# Altium project science-board-24.PrjPcb
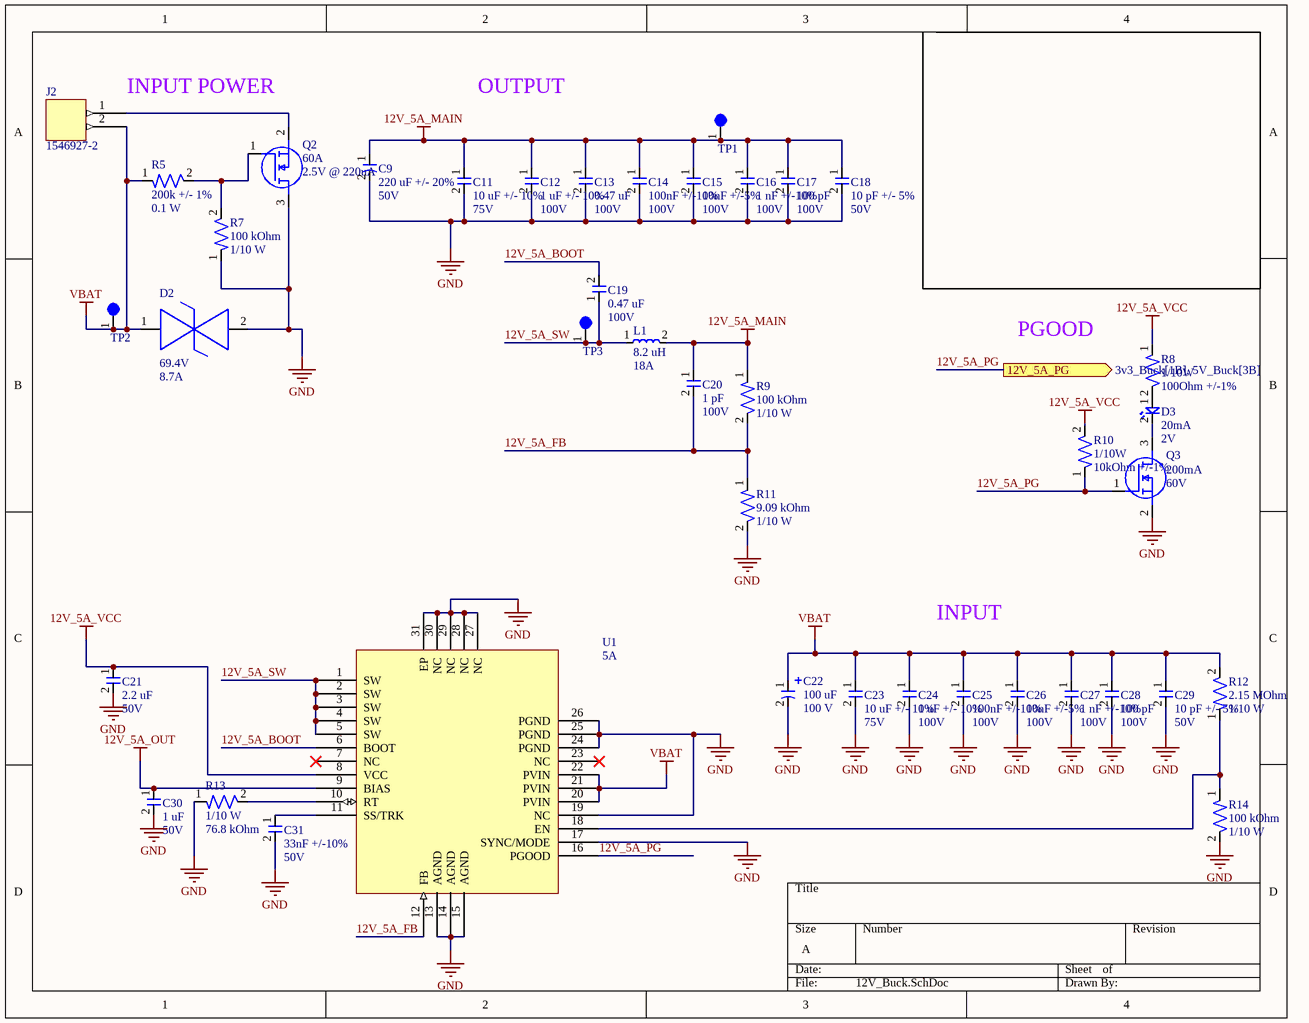
[diagram p0: 12V_Buck.SchDoc]
6 sheets, 231 parts. Net scope: flat (ports and power ports of the same name join across sheets).
Board file: Science_Board_PCB.PcbDoc
Sheets:
  12V_Buck.SchDoc
  5V_Buck.SchDoc
  3v3_Buck.SchDoc
  MCU_Sensors_CAN.SchDoc
  3v3_LDO.SchDoc
  MOSFETS.SchDoc

## Sheet 12V_Buck.SchDoc
size A; SheetNumber: 1; SheetTotal: 6

### Parts
C9  Capacitance: 220 uF +/- 20%  Voltage Rating: 50V  [ELEC-220U-0003]  (hidden comment: 50TZV220M10X10.5)
C11  Capacitance: 10 uF +/- 10%  Voltage Rating: 75V  [CAP-1210]  (hidden comment: C3225X7R1N106K250AC)
C12  Capacitance: 1 uF +/- 10%  Voltage: 100V  [CAP-1206 - duplicate]  (hidden comment: CL31B105KCHNNNE)
C13  Capacitance: 0.47 uF  Voltage: 100V  [CAP-0805]  (hidden comment: KAM21KR72A474KL)
C14  Capacitance: 100nF +/-10%  Voltage Rating: 100V  [CAP-0603]  (hidden comment: CC0603KRX7R0BB104)
C15  Capacitance: 10nF +/-5%  Voltage Rating: 100V  [CAP-0603]  (hidden comment: C1608C0G2A103J080AC)
C16  Capacitance: 1 nF +/-10%  Voltage: 100V  [CAP-0603]  (hidden comment: C0603Y102K1RAC7867)
C17  Capacitance: 100 pF  Voltage: 100V  [CAP-0603]  (hidden comment: 0603N101J101CT)
C18  Capacitance: 10 pF +/- 5%  Voltage Rating: 50V  [CAP-0603]  (hidden comment: 0603N100J500CT)
C19  Capacitance: 0.47 uF  Voltage: 100V  [CAP-0805]  (hidden comment: KAM21KR72A474KL)
C20  Capacitance: 1 pF  Voltage: 100V  [CAP-0603]  (hidden comment: 885012006087)
C21  Capacitance: 2.2 uF  oltage: 50V  [CAP-0603]  (hidden comment: UMK107BBJ225KA-T)
C22  Capacitance: 100 uF  Voltage: 100 V  [ELEC-100U-0001]  (hidden comment: 100SEV100M12.5X16)
C23  Capacitance: 10 uF +/- 10%  Voltage Rating: 75V  [CAP-1210]  (hidden comment: C3225X7R1N106K250AC)
C24  Capacitance: 1 uF +/- 10%  Voltage: 100V  [CAP-1206 - duplicate]  (hidden comment: CL31B105KCHNNNE)
C25  Capacitance: 100nF +/-10%  Voltage Rating: 100V  [CAP-0603]  (hidden comment: CC0603KRX7R0BB104)
C26  Capacitance: 10nF +/-5%  Voltage Rating: 100V  [CAP-0603]  (hidden comment: C1608C0G2A103J080AC)
C27  Capacitance: 1 nF +/-10%  Voltage: 100V  [CAP-0603]  (hidden comment: C0603Y102K1RAC7867)
C28  Capacitance: 100 pF  Voltage: 100V  [CAP-0603]  (hidden comment: 0603N101J101CT)
C29  Capacitance: 10 pF +/- 5%  Voltage Rating: 50V  [CAP-0603]  (hidden comment: 0603N100J500CT)
C30  Capacitance: 1 uF  Voltage: 50V  [CAP-0603]  (hidden comment: UMK107AB7105KA-T)
C31  Capacitance: 33nF +/-10%  Voltage Rating: 50V  [CAP-0603]  (hidden comment: CC0603KRX7R9BB333)
D2  Vclamp: 69.4V  Peak pulser current: 8.7A  [DO-214AA (SMBJ)]  (hidden comment: SMBJE43CAH)
D3  Current Rating: 20mA  Vf: 2V  [LED-0603]  (hidden comment: 150060AS75000)
J2  1546927-2  [CONN-1546927-2]
L1  Inductance: 8.2 uH  DCI: 18A  [PWRIND-8.2U-0002]  (hidden comment: IHLP6767GZER8R2M01)
Q2  Drain Current: 60A  Vgs: 2.5V @ 220uA  [NMOS-8PowerVDFN]  (hidden comment: TPH7R006PL,L1Q)
Q3  Id-Continuous: 200mA  VDS-Max: 60V  [NMOS-SOT23-3]  (hidden comment: T2N7002AK,LM)
R5  Resistance: 200k +/- 1%  Power Rating: 0.1 W  [RES-0603]  (hidden comment: ERJ-3EKF2003V)
R7  Resistance: 100 kOhm  Power: 1/10 W  [RES-0603]  (hidden comment: RC0603FR-07100KL)
R8  Power Rating: 1/10W  Resistance: 100Ohm +/-1%  [RES-0603]  (hidden comment: AC0603FR-10100RL)
R9  Resistance: 100 kOhm  Power: 1/10 W  [RES-0603]  (hidden comment: RC0603FR-07100KL)
R10  Power Rating: 1/10W  Resistance: 10kOhm +/-1%  [RES-0603]  (hidden comment: RC0603FR-0710KP)
R11  Resistance: 9.09 kOhm  Power: 1/10 W  [RES-0603]  (hidden comment: RC0603FR-079K09L)
R12  Resistance: 2.15 MOhm  Power: 1/10 W  [RES-0603]  (hidden comment: RC0603FR-072M15L)
R13  Power: 1/10 W  Resistance: 76.8 kOhm  [RES-0603]  (hidden comment: RC0603FR-0776K8L)
R14  Resistance: 100 kOhm  Power: 1/10 W  [RES-0603]  (hidden comment: RC0603FR-07100KL)
TP1  5003  [TEST-POINT-0001]  (value not drawn)
TP2  5003  [TEST-POINT-0001]  (value not drawn)
TP3  5003  [TEST-POINT-0001]  (value not drawn)
U1  Current: 5A  [IC-30-WQFN(6x4)]  (hidden comment: LM76005RNPR)

### Ports
12V_5A_PG (out, see 3v3_Buck[1B], 5V_Buck[3B])

### Nets
12V_5A_MAIN: C9.1 C11.1 C12.1 C13.1 C14.1 C15.1 C16.1 C17.1 C18.1 C20.1 L1.2 R9.1 TP1.1
12V_5A_OUT: C30.1 U1.9(BIAS)
12V_5A_VCC: C21.1 R8.1 R10.2 U1.8(VCC)
GND: C9.2 C11.2 C12.2 C13.2 C14.2 C15.2 C16.2 C17.2 C18.2 C21.2 C22.2 C23.2 C24.2 C25.2 C26.2 C27.2 C28.2 C29.2 C30.2 C31.2 D2.2 Q2.3(D) Q3.2(S) R7.1 R11.2 R13.1 R14.2 U1.13(AGND) U1.14(AGND) U1.15(AGND) U1.17(SYNC/MODE) U1.19(NC) U1.24(PGND) U1.25(PGND) U1.26(PGND) U1.27(NC) U1.28(NC) U1.29(NC) U1.30(NC) U1.31(EP)
VBAT: C22.1 C23.1 C24.1 C25.1 C26.1 C27.1 C28.1 C29.1 D2.1 J2.2 R5.1 R12.2 TP2.1 U1.20(PVIN) U1.21(PVIN) U1.22(PVIN)
12V_5A_BOOT: C19.2 U1.6(BOOT)
12V_5A_FB: C20.2 R9.2 R11.1 U1.12(FB)
12V_5A_PG: Q3.1(G) R10.1 U1.16(PGOOD) ; port 12V_5A_PG
12V_5A_SW: C19.1 L1.1 TP3.1 U1.1(SW) U1.2(SW) U1.3(SW) U1.4(SW) U1.5(SW)
NetC31_1: C31.1 U1.11(SS/TRK)
NetD3_1: D3.1 R8.2
NetD3_2: D3.2 Q3.3(D)
NetJ2_1: J2.1 Q2.2(S)
NetQ2_1: Q2.1(G) R5.2 R7.2
NetR12_1: R12.1 R14.1 U1.18(EN)
NetR13_2: R13.2 U1.10(RT)

Not connected (* = marked no-connect by the designer): U1 7(NC)* 23(NC)*

### Notes on the sheet
- INPUT POWER
- OUTPUT
- PGOOD
- INPUT

### Library data of the parts
C9 = ELEC-220U-0003: 220 µF 50 V Aluminum Electrolytic Capacitors Radial, Can - SMD 2000 Hrs @ 105°C; Size: .406inx.406in*.413in
C11 C23 = CAP-10U-0004: 10 µF ±10% 75V Ceramic Capacitor X7R 1210 (3225 Metric)
C12 C24 = CAP-1U-0001: 1 µF ±10% 100V Ceramic Capacitor X7R 1206 (3216 Metric)
C13 C19 = CAP-0.47U-0001: 0.47 µF ±10% 100V Ceramic Capacitor X7R 0805 (2012 Metric); Tolerance: +/- 10%; Assembled?: No; Temperature Coefficient: X7R; Package Size: 0805
C14 C25 = CAP-100N-0001: CAP CER 0.1UF 100V X7R 0603; Manufacturer: YAGEO; Assembled?: no; Manufacturer Part Number: CC0603KRX7R0BB104; Temperature Coefficient: X7R; Package Size: 0603
C15 C26 = CAP-10N-0002: CAP CER 10000PF 100V C0G 0603; Manufacturer: TDK Corporation; Temperature Coefficient: C0G/NP0; Assembled?: no; Manufacturer Part Number: C1608C0G2A103J080AC; Package Size: 0603
C16 C27 = CAP-1N-0001: 1000 pF ±10% 100V Ceramic Capacitor X7R 0603 (1608 Metric)
C17 C28 = CAP-100P-0002: 100 pF ±5% 100V Ceramic Capacitor C0G, NP0 0603 (1608 Metric); Tolerance: +/-5%; Temp Coeff: C0G/NP0; Package Size: 0603
C18 C29 = CAP-10P-0001: 10 pF ±5% 50V Ceramic Capacitor C0G, NP0 0603 (1608 Metric); Manufacturer: Walshin Technology Corporation; Assembled?: Yes; Manufacturer Part Number: 0603N100J500CT; Temperature Coefficient: C0G, NP0; Package Size: 0603
C20 = CAP-1P-0001: 1 pF ±0.25pF 100V Ceramic Capacitor C0G, NP0 0603 (1608 Metric); Tolerance: +/- 0.25 pF; Temperature Coefficient: C0G/NP0; Assembled?: No; Package Size: 0603
C21 = CAP-2.2U-0001: 2.2 µF ±10% 50V Ceramic Capacitor X5R 0603 (1608 Metric)
C22 = ELEC-100U-0001: 100 µF 100 V Aluminum Electrolytic Capacitors Radial, Can - SMD 2000 Hrs @ 85°C; Manufacturer: Rubycon; Tolerance: +/- 20%; Assembled?: No; ESR: idk check the datasheet i couldnt find it
C30 = CAP-1U-0002: 1 µF ±10% 50V Ceramic Capacitor X7R 0603 (1608 Metric); Package Size: 0603
C31 = CAP-33N-0001: 0.033 µF ±10% 50V Ceramic Capacitor X7R 0603 (1608 Metric); Manufacturer: YAGEO; Assembled?: no; Manufacturer Part Number: CC0603KRX7R9BB333; Temperature Coefficient: X7R; Package Size: 0603
D2 = DIO-69.4V-0001: 69.4V Clamp 8.7A Ipp Tvs Diode Surface Mount DO-214AA (SMBJ); Channels: Bidirectional; Breakdown VOltage: 47.8V; Reverse working maximum voltage: 43V; Package: DO-214AA (SMBJ)
D3 = LED_Amber_0001: CAP CER 0.1UF 100V X7R 0603; Manufacturer: Wurth Electronik; Assembled?: no; Color: Amber; Manufacturer Part Number: 150060AS75000; Package Size: 0603
J2 = CON-2POS-0003
L1 = PWRIND-8.2U-0002: 8.2 µH Shielded Molded Inductor 18 A 10.66mOhm Max Nonstandard; Isat: 25A; Tolerance: +/-20%; DCR: 10.66 mOhm
Q2 = NMOS-60A-0001: N-Channel 60 V 60A (Tc) 81W (Tc) Surface Mount 8-SOP Advance (5x5); Vdss: 60V; Vgs(Max): 20V; Package: 8-PowerVDFN
Q3 = NMOS-200MA-0001: MOSFET N-CH 60V 200MA SOT23; Manufacturer: Toshiba; FET type: N-Channel; Rds On-Max: 3.9Ohm; Vgs-Max: 20V; Assembled?: no; Manufacturer Part Number: T2N7002AK,LM; Package: SOT-23-3
R5 = RES-200K-0001: 200 kOhms ±1% 0.1W, 1/10W Chip Resistor 0603 (1608 Metric) Automotive AEC-Q200 Thick Film; Manufacturer: Panasonic Electronic Components; Assembled?: Yes; MFP: ERJ-3EKF2003V; Package SIze: 0603
R7 R9 R14 = RES-100K-0003: 100 kOhms ±1% 0.1W, 1/10W Chip Resistor 0603 (1608 Metric) Moisture Resistant Thick Film; Tolerance: +/- 1%; Assembled?: No; Package Size: 0603
R8 = RES-100-0002: 100 Ohms ±1% 0.1W, 1/10W Chip Resistor 0603 (1608 Metric) Automotive AEC-Q200 Thick Film; Manufacturer: YAGEO; Assembled?: no; Manufacturer Part Number: AC0603FR-10100RL; Package Size: 0603
R10 = RES-10K-0002: RES SMD 10K OHM 1% 1/10W 0603; Manufacturer: YAGEO; Assembled?: no; Manufacturer Part Number: RC0603FR-0710KP; Package Size: 0603
R11 = RES-9.09K-0001: 9.09 kOhms ±1% 0.1W, 1/10W Chip Resistor 0603 (1608 Metric) Moisture Resistant Thick Film; Tolerance: +/-1%; Assembled?: No; Package Size: 0603
R12 = RES-2.15M-0001: 2.15 MOhms ±1% 0.1W, 1/10W Chip Resistor 0603 (1608 Metric) Moisture Resistant Thick Film; Tolerance: +/-1%; Assembled?: No; Package Size: 0603
R13 = RES-76.8K-0001: 76.8 kOhms ±1% 0.1W, 1/10W Chip Resistor 0603 (1608 Metric) Moisture Resistant Thick Film; Manufacturer: Yageo; Tolerance: +/- 1%; Package Size: 0603
TP1-TP3 = TEST-POINT-0001: Oranange PC Test Point, Miniature Phoisphor Bronze Silver Plating Through Hole Mounting Type
U1 = IC-BUCK-0006: Buck Switching Regulator IC Positive Adjustable 1V 1 Output 5A 30-WFQFN Exposed Pad; Manufacturer: Texas Instruments; Assembled?: no; Manufacturer Part Number: LM76005RNPR; Type: Buck; Package: 30-WFQFN

## Sheet 5V_Buck.SchDoc
size A; SheetNumber: 2; SheetTotal: 6
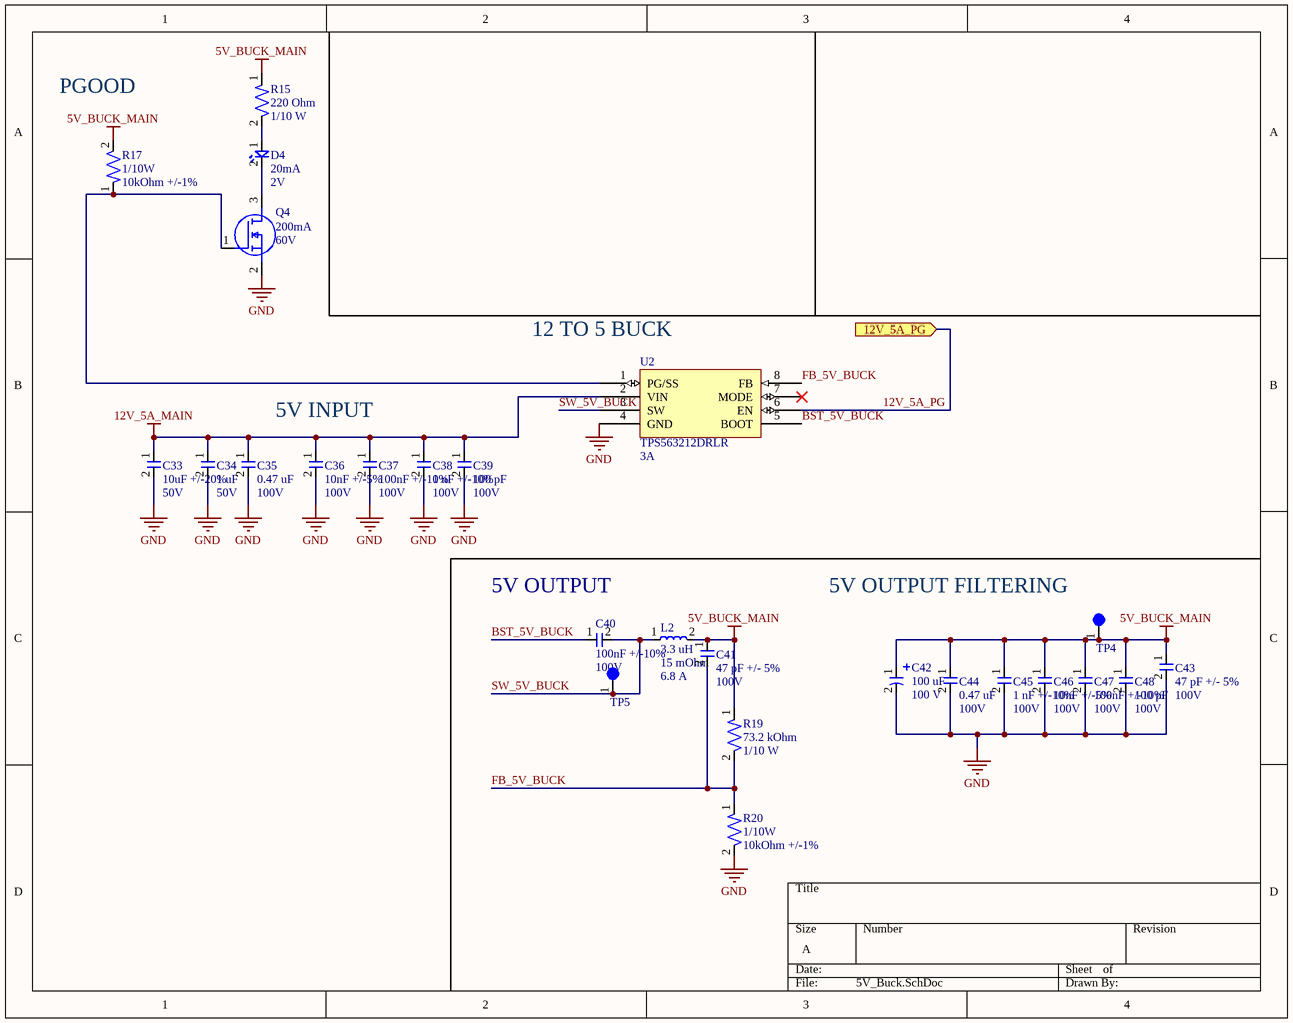
[diagram p1: 5V_Buck.SchDoc]

### Parts
C33  Capacitance: 10uF +/-20%  Voltage Rating: 50V  [CAP-1206]  (hidden comment: CL31B106KBHNNNE)
C34  Capacitance: 1 uF  Voltage: 50V  [CAP-0603]  (hidden comment: UMK107AB7105KA-T)
C35  Capacitance: 0.47 uF  Voltage: 100V  [CAP-0805]  (hidden comment: KAM21KR72A474KL)
C36  Capacitance: 10nF +/-5%  Voltage Rating: 100V  [CAP-0603]  (hidden comment: C1608C0G2A103J080AC)
C37  Capacitance: 100nF +/-10%  Voltage Rating: 100V  [CAP-0603]  (hidden comment: CC0603KRX7R0BB104)
C38  Capacitance: 1 nF +/-10%  Voltage: 100V  [CAP-0603]  (hidden comment: C0603Y102K1RAC7867)
C39  Capacitance: 100 pF  Voltage: 100V  [CAP-0603]  (hidden comment: 0603N101J101CT)
C40  Capacitance: 100nF +/-10%  Voltage Rating: 100V  [CAP-0603]  (hidden comment: CC0603KRX7R0BB104)
C41  Capacitance: 47 pF +/- 5%  Voltage Rating: 100V  [CAP-0603]  (hidden comment: 7447798111)
C42  Capacitance: 100 uF  Voltage: 100 V  [ELEC-100U-0001]  (hidden comment: 100SEV100M12.5X16)
C43  Capacitance: 47 pF +/- 5%  Voltage Rating: 100V  [CAP-0603]  (hidden comment: 7447798111)
C44  Capacitance: 0.47 uF  Voltage: 100V  [CAP-0805]  (hidden comment: KAM21KR72A474KL)
C45  Capacitance: 1 nF +/-10%  Voltage: 100V  [CAP-0603]  (hidden comment: C0603Y102K1RAC7867)
C46  Capacitance: 10nF +/-5%  Voltage Rating: 100V  [CAP-0603]  (hidden comment: C1608C0G2A103J080AC)
C47  Capacitance: 100nF +/-10%  Voltage Rating: 100V  [CAP-0603]  (hidden comment: CC0603KRX7R0BB104)
C48  Capacitance: 100 pF  Voltage: 100V  [CAP-0603]  (hidden comment: 0603N101J101CT)
D4  Current Rating: 20mA  Vf: 2V  [LED-0603]  (hidden comment: 150060AS75000)
L2  Inductance: 3.3 uH  DCR: 15 mOhm  DCI: 6.8 A  [PWRIND-3.3U-0003]  (hidden comment: SRR1240-3R3Y)
Q4  Id-Continuous: 200mA  VDS-Max: 60V  [NMOS-SOT23-3]  (hidden comment: T2N7002AK,LM)
R15  Resistance: 220 Ohm  Power: 1/10 W  [RES-0603]  (hidden comment: CRGCQ0603J220R)
R17  Power Rating: 1/10W  Resistance: 10kOhm +/-1%  [RES-0603]  (hidden comment: RC0603FR-0710KP)
R19  Resistance: 73.2 kOhm  Power: 1/10 W  [RES-0603]  (hidden comment: RC0603FR-0773K2L)
R20  Power Rating: 1/10W  Resistance: 10kOhm +/-1%  [RES-0603]  (hidden comment: RC0603FR-0710KP)
TP4  5003  [TEST-POINT-0001]  (value not drawn)
TP5  5003  [TEST-POINT-0001]  (value not drawn)
U2  TPS563212DRLR  Current: 3A  [IC-SOT583]

### Ports
12V_5A_PG (in, see 3v3_Buck[1B], 12V_Buck[4B])

### Nets
5V_BUCK_MAIN: C41.1 C42.1 C43.1 C44.1 C45.1 C46.1 C47.1 C48.1 L2.2 R15.1 R17.2 R19.1 TP4.1  [project net 5V]
12V_5A_MAIN: C33.1 C34.1 C35.1 C36.1 C37.1 C38.1 C39.1 U2.2(VIN)
GND: C33.2 C34.2 C35.2 C36.2 C37.2 C38.2 C39.2 C42.2 C43.2 C44.2 C45.2 C46.2 C47.2 C48.2 Q4.2(S) R20.2 U2.4(GND)
12V_5A_PG: U2.6(EN) ; port 12V_5A_PG
BST_5V_BUCK: C40.1 U2.5(BOOT)
FB_5V_BUCK: C41.2 R19.2 R20.1 U2.8(FB)
SW_5V_BUCK: C40.2 L2.1 TP5.1 U2.3(SW)
NetD4_1: D4.1 R15.2
NetD4_2: D4.2 Q4.3(D)
NetQ4_1: Q4.1(G) R17.1 U2.1(PG/SS)

Not connected (* = marked no-connect by the designer): U2 7(MODE)*

### Notes on the sheet
- (near R17) PGOOD
- (near U2) 12 TO 5 BUCK
- 5V INPUT
- (near C40) 5V OUTPUT
- 5V OUTPUT FILTERING

### Library data of the parts
C33 = CAP-10U-0001: 10 µF ±10% 50V Ceramic Capacitor X7R 1206 (3216 Metric); Manufacturer: Samsung Electro-Mechanics; Assembled?: no; Manufacturer Part Number: CL31B106KBHNNNE; Temperature Coefficient: X7R; Package Size: 1206
C34 = CAP-1U-0002: as C30 on sheet 12V_Buck; Package Size: 0603
C35 C44 = CAP-0.47U-0001: as C13 on sheet 12V_Buck; Temperature Coefficient: X7R; Package Size: 0805
C36 C46 = CAP-10N-0002: as C15 on sheet 12V_Buck; Manufacturer Part Number: C1608C0G2A103J080AC; Package Size: 0603
C37 C40 C47 = CAP-100N-0001: as C14 on sheet 12V_Buck; Manufacturer Part Number: CC0603KRX7R0BB104; Temperature Coefficient: X7R; Package Size: 0603
C38 C45 = CAP-1N-0001: as C16 on sheet 12V_Buck
C39 C48 = CAP-100P-0002: as C17 on sheet 12V_Buck; Package Size: 0603
C41 C43 = CAP-47P-0001: 47 pF ±5% 100V Ceramic Capacitor C0G, NP0 0603 (1608 Metric)
C42 = ELEC-100U-0001: as C22 on sheet 12V_Buck
D4 = LED_Amber_0001: as D3 on sheet 12V_Buck; Manufacturer Part Number: 150060AS75000; Package Size: 0603
L2 = PWRIND-3.3U-0003: 3.3 µH Shielded Drum Core, Wirewound Inductor 6.8 A 15mOhm Max Nonstandard; Isat: 6.5A; Tolerance: 30%; Assembled?: No
Q4 = NMOS-200MA-0001: as Q3 on sheet 12V_Buck; Manufacturer Part Number: T2N7002AK,LM; Package: SOT-23-3
R15 = RES-220-003: 220 Ohms ±5% 0.1W, 1/10W Chip Resistor 0603 (1608 Metric) Automotive AEC-Q200, Moisture Resistant Thick Film; Tolerance: +/- 5%; Package Size: 0603
R17 R20 = RES-10K-0002: as R10 on sheet 12V_Buck; Manufacturer Part Number: RC0603FR-0710KP; Package Size: 0603
R19 = RES-73.2K-0001: 73.2 kOhms ±1% 0.1W, 1/10W Chip Resistor 0603 (1608 Metric) Moisture Resistant Thick Film; Assembled?: No; Tolerance: 1%; Package Size: 0603
TP4 TP5 = TEST-POINT-0001: as TP1 on sheet 12V_Buck
U2 = IC-BUCK-0008: Buck Switching Regulator IC Positive Adjustable 0.6V 1 Output 3A SOT-583; Manufacturer: Texaas Instruments; Assembled?: no; Manufacturer Part Number: TPS563212DRLR; Type: Buck; Package Size: SOT-583

## Sheet 3v3_Buck.SchDoc
size A; SheetNumber: 3; SheetTotal: 6
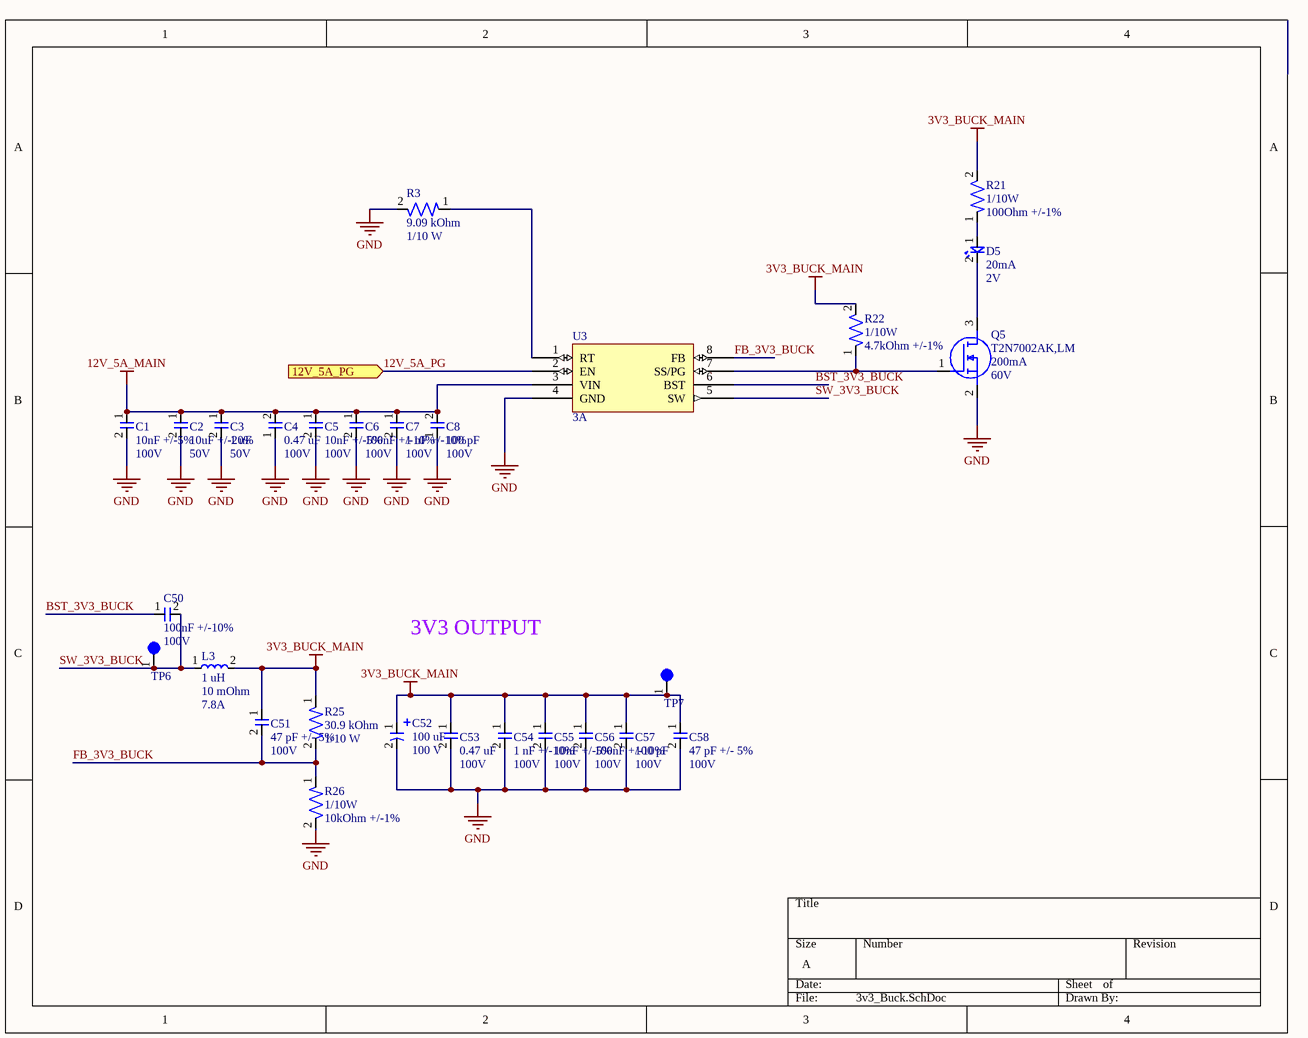
[diagram p2: 3v3_Buck.SchDoc]

### Parts
C1  Capacitance: 10nF +/-5%  Voltage Rating: 100V  [CAP-0603]  (hidden comment: C1608C0G2A103J080AC)
C2  Capacitance: 10uF +/-20%  Voltage Rating: 50V  [CAP-1206]  (hidden comment: CL31B106KBHNNNE)
C3  Capacitance: 1 uF  Voltage: 50V  [CAP-0603]  (hidden comment: UMK107AB7105KA-T)
C4  Capacitance: 0.47 uF  Voltage: 100V  [CAP-0805]  (hidden comment: KAM21KR72A474KL)
C5  Capacitance: 10nF +/-5%  Voltage Rating: 100V  [CAP-0603]  (hidden comment: C1608C0G2A103J080AC)
C6  Capacitance: 100nF +/-10%  Voltage Rating: 100V  [CAP-0603]  (hidden comment: CC0603KRX7R0BB104)
C7  Capacitance: 1 nF +/-10%  Voltage: 100V  [CAP-0603]  (hidden comment: C0603Y102K1RAC7867)
C8  Capacitance: 100 pF  Voltage: 100V  [CAP-0603]  (hidden comment: 0603N101J101CT)
C50  Capacitance: 100nF +/-10%  Voltage Rating: 100V  [CAP-0603]  (hidden comment: CC0603KRX7R0BB104)
C51  Capacitance: 47 pF +/- 5%  Voltage Rating: 100V  [CAP-0603]  (hidden comment: 7447798111)
C52  Capacitance: 100 uF  Voltage: 100 V  [ELEC-100U-0001]  (hidden comment: 100SEV100M12.5X16)
C53  Capacitance: 0.47 uF  Voltage: 100V  [CAP-0805]  (hidden comment: KAM21KR72A474KL)
C54  Capacitance: 1 nF +/-10%  Voltage: 100V  [CAP-0603]  (hidden comment: C0603Y102K1RAC7867)
C55  Capacitance: 10nF +/-5%  Voltage Rating: 100V  [CAP-0603]  (hidden comment: C1608C0G2A103J080AC)
C56  Capacitance: 100nF +/-10%  Voltage Rating: 100V  [CAP-0603]  (hidden comment: CC0603KRX7R0BB104)
C57  Capacitance: 100 pF  Voltage: 100V  [CAP-0603]  (hidden comment: 0603N101J101CT)
C58  Capacitance: 47 pF +/- 5%  Voltage Rating: 100V  [CAP-0603]  (hidden comment: 7447798111)
D5  Current Rating: 20mA  Vf: 2V  [LED-0603]  (hidden comment: 150060AS75000)
L3  Inductance: 1 uH  DCR: 10 mOhm  DCI: 7.8A  [PWRIND-6.8U-0001]  (hidden comment: SRN8040-1R0Y)
Q5  T2N7002AK,LM  Id-Continuous: 200mA  VDS-Max: 60V  [NMOS-SOT23-3]
R3  Resistance: 9.09 kOhm  Power: 1/10 W  [RES-0603]  (hidden comment: RC0603FR-079K09L)
R21  Power Rating: 1/10W  Resistance: 100Ohm +/-1%  [RES-0603]  (hidden comment: AC0603FR-10100RL)
R22  Power Rating: 1/10W  Resistance: 4.7kOhm +/-1%  [RES-0603]  (hidden comment: AF0603FR-074K7L)
R25  Resistance: 30.9 kOhm  Power: 1/10 W  [RES-0603]  (hidden comment: RC0603FR-0730K9L)
R26  Power Rating: 1/10W  Resistance: 10kOhm +/-1%  [RES-0603]  (hidden comment: RC0603FR-0710KP)
TP6  5003  [TEST-POINT-0001]  (value not drawn)
TP7  5003  [TEST-POINT-0001]  (value not drawn)
U3  Current: 3A  [IC-SOT583]  (hidden comment: TPS62933ODRLR)

### Ports
12V_5A_PG (in, see 5V_Buck[3B], 12V_Buck[4B])

### Nets
3V3_BUCK_MAIN: C51.1 C52.1 C53.1 C54.1 C55.1 C56.1 C57.1 C58.1 L3.2 R21.2 R22.2 R25.1 TP7.1
12V_5A_MAIN: C1.1 C2.1 C3.1 C4.2 C5.1 C6.1 C7.1 C8.2 U3.3(VIN)
GND: C1.2 C2.2 C3.2 C4.1 C5.2 C6.2 C7.2 C8.1 C52.2 C53.2 C54.2 C55.2 C56.2 C57.2 C58.2 Q5.2(S) R3.2 R26.2 U3.4(GND)
12V_5A_PG: U3.2(EN) ; port 12V_5A_PG
BST_3V3_BUCK: C50.1 U3.6(BST)
FB_3V3_BUCK: C51.2 R25.2 R26.1 U3.8(FB)
SW_3V3_BUCK: C50.2 L3.1 TP6.1 U3.5(SW)
NetD5_1: D5.1 R21.1
NetD5_2: D5.2 Q5.3(D)
NetQ5_1: Q5.1(G) R22.1 U3.7(SS/PG)
NetR3_1: R3.1 U3.1(RT)

### Notes on the sheet
- 3V3 OUTPUT

### Library data of the parts
C1 C5 C55 = CAP-10N-0002: as C15 on sheet 12V_Buck; Manufacturer Part Number: C1608C0G2A103J080AC; Package Size: 0603
C2 = CAP-10U-0001: as C33 on sheet 5V_Buck; Manufacturer Part Number: CL31B106KBHNNNE; Temperature Coefficient: X7R; Package Size: 1206
C3 = CAP-1U-0002: as C30 on sheet 12V_Buck; Package Size: 0603
C4 C53 = CAP-0.47U-0001: as C13 on sheet 12V_Buck; Temperature Coefficient: X7R; Package Size: 0805
C6 C50 C56 = CAP-100N-0001: as C14 on sheet 12V_Buck; Manufacturer Part Number: CC0603KRX7R0BB104; Temperature Coefficient: X7R; Package Size: 0603
C7 C54 = CAP-1N-0001: as C16 on sheet 12V_Buck
C8 C57 = CAP-100P-0002: as C17 on sheet 12V_Buck; Package Size: 0603
C51 C58 = CAP-47P-0001: as C41 on sheet 5V_Buck
C52 = ELEC-100U-0001: as C22 on sheet 12V_Buck
D5 = LED_Amber_0001: as D3 on sheet 12V_Buck; Manufacturer Part Number: 150060AS75000; Package Size: 0603
L3 = PWRIND-1U-0001: 1 µH Semi-Shielded Drum Core, Wirewound Inductor 7.8 A 10mOhm Max Nonstandard; Isat: 11A; Tolerance: 30%; Assembled?: No
Q5 = NMOS-200MA-0001: as Q3 on sheet 12V_Buck; Manufacturer Part Number: T2N7002AK,LM; Package: SOT-23-3
R3 = RES-9.09K-0001: as R11 on sheet 12V_Buck; Package Size: 0603
R21 = RES-100-0002: as R8 on sheet 12V_Buck; Manufacturer Part Number: AC0603FR-10100RL; Package Size: 0603
R22 = RES-4.7K-0002: RES SMD 4.7K OHM 1% 1/10W 0603; Manufacturer: YAGEO; Assembled?: no; Manufacturer Part Number: AF0603FR-074K7L; Package Size: 0603
R25 = RES-30.9K-0001: 30.9 kOhms ±1% 0.1W, 1/10W Chip Resistor 0603 (1608 Metric) Moisture Resistant Thick Film; Assembled?: No; Tolerance: 1%; Package Size: 0603
R26 = RES-10K-0002: as R10 on sheet 12V_Buck; Manufacturer Part Number: RC0603FR-0710KP; Package Size: 0603
TP6 TP7 = TEST-POINT-0001: as TP1 on sheet 12V_Buck
U3 = IC-BUCK-0010: Buck Switching Regulator IC Positive Adjustable 0.8V 1 Output 3A SOT-583; Manufacturer: Texas Instruments; Assembled?: no; Manufacturer Part Number: TPS62933ODRLR; Type: Buck

## Sheet MCU_Sensors_CAN.SchDoc
size B; SheetNumber: 4; SheetTotal: 6
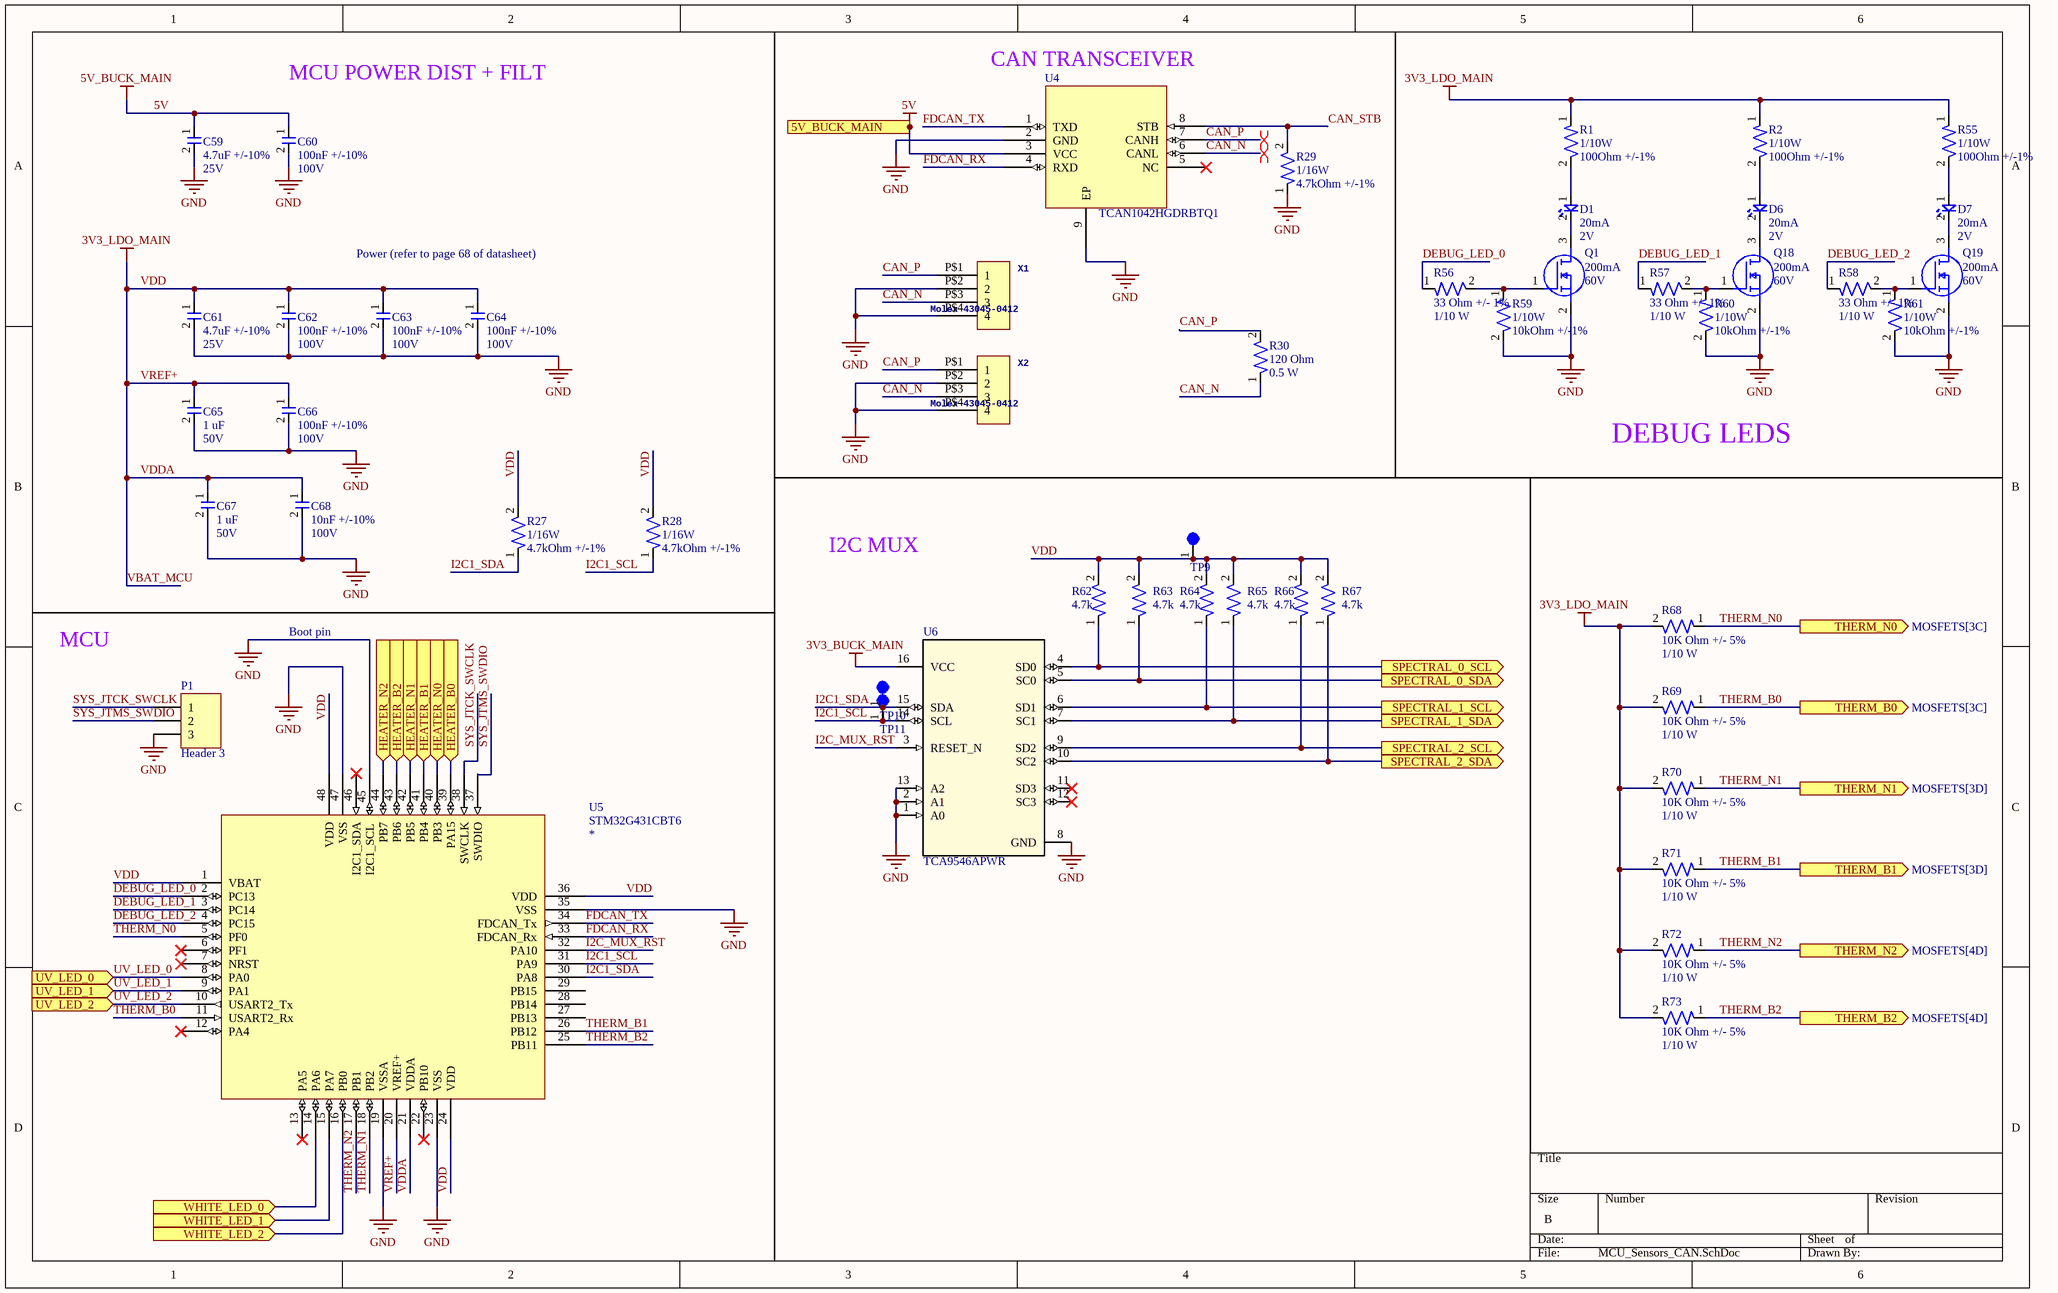
[diagram p3: MCU_Sensors_CAN.SchDoc]

### Parts
C59  Capacitance: 4.7uF +/-10%  Voltage Rating: 25V  [CAP-0603]  (hidden comment: TMK107BBJ475KA-T)
C60  Capacitance: 100nF +/-10%  Voltage Rating: 100V  [CAP-0603]  (hidden comment: CC0603KRX7R0BB104)
C61  Capacitance: 4.7uF +/-10%  Voltage Rating: 25V  [CAP-0603]  (hidden comment: TMK107BBJ475KA-T)
C62  Capacitance: 100nF +/-10%  Voltage Rating: 100V  [CAP-0603]  (hidden comment: CC0603KRX7R0BB104)
C63  Capacitance: 100nF +/-10%  Voltage Rating: 100V  [CAP-0603]  (hidden comment: CC0603KRX7R0BB104)
C64  Capacitance: 100nF +/-10%  Voltage Rating: 100V  [CAP-0603]  (hidden comment: CC0603KRX7R0BB104)
C65  Capacitance: 1 uF  Voltage: 50V  [CAP-0603]  (hidden comment: UMK107AB7105KA-T)
C66  Capacitance: 100nF +/-10%  Voltage Rating: 100V  [CAP-0603]  (hidden comment: CC0603KRX7R0BB104)
C67  Capacitance: 1 uF  Voltage: 50V  [CAP-0603]  (hidden comment: UMK107AB7105KA-T)
C68  Capacitance: 10nF +/-10%  Voltage Rating: 100V  [CAP-0402]  (hidden comment: CC0402KRX7R0BB103)
D1  Current Rating: 20mA  Vf: 2V  [LED-0603]  (hidden comment: 150060AS75000)
D6  Current Rating: 20mA  Vf: 2V  [LED-0603]  (hidden comment: 150060AS75000)
D7  Current Rating: 20mA  Vf: 2V  [LED-0603]  (hidden comment: 150060AS75000)
P1  Header 3  [HDR1X3]
Q1  Id-Continuous: 200mA  VDS-Max: 60V  [NMOS-SOT23-3]  (hidden comment: T2N7002AK,LM)
Q18  Id-Continuous: 200mA  VDS-Max: 60V  [NMOS-SOT23-3]  (hidden comment: T2N7002AK,LM)
Q19  Id-Continuous: 200mA  VDS-Max: 60V  [NMOS-SOT23-3]  (hidden comment: T2N7002AK,LM)
R1  Power Rating: 1/10W  Resistance: 100Ohm +/-1%  [RES-0603]  (hidden comment: AC0603FR-10100RL)
R2  Power Rating: 1/10W  Resistance: 100Ohm +/-1%  [RES-0603]  (hidden comment: AC0603FR-10100RL)
R27  Power Rating: 1/16W  Resistance: 4.7kOhm +/-1%  [RES-0402]  (hidden comment: RC0402FR-074K7P)
R28  Power Rating: 1/16W  Resistance: 4.7kOhm +/-1%  [RES-0402]  (hidden comment: RC0402FR-074K7P)
R29  Power Rating: 1/16W  Resistance: 4.7kOhm +/-1%  [RES-0402]  (hidden comment: RC0402FR-074K7P)
R30  Resistance: 120 Ohm  Power: 0.5 W  [RES-1206]  (hidden comment: CRGH1206F120R)
R55  Power Rating: 1/10W  Resistance: 100Ohm +/-1%  [RES-0603]  (hidden comment: AC0603FR-10100RL)
R56  Resistance: 33 Ohm +/- 1%  Power: 1/10 W  [RES-0402]  (hidden comment: ERJ2RKF33R0X)
R57  Resistance: 33 Ohm +/- 1%  Power: 1/10 W  [RES-0402]  (hidden comment: ERJ2RKF33R0X)
R58  Resistance: 33 Ohm +/- 1%  Power: 1/10 W  [RES-0402]  (hidden comment: ERJ2RKF33R0X)
R59  Power Rating: 1/10W  Resistance: 10kOhm +/-1%  [RES-0603]  (hidden comment: RC0603FR-0710KP)
R60  Power Rating: 1/10W  Resistance: 10kOhm +/-1%  [RES-0603]  (hidden comment: RC0603FR-0710KP)
R61  Power Rating: 1/10W  Resistance: 10kOhm +/-1%  [RES-0603]  (hidden comment: RC0603FR-0710KP)
R62  Resistance: 4.7k  [RES-0402]  (hidden comment: RC0402FR-074K7P)
R63  Resistance: 4.7k  [RES-0402]  (hidden comment: RC0402FR-074K7P)
R64  Resistance: 4.7k  [RES-0402]  (hidden comment: RC0402FR-074K7P)
R65  Resistance: 4.7k  [RES-0402]  (hidden comment: RC0402FR-074K7P)
R66  Resistance: 4.7k  [RES-0402]  (hidden comment: RC0402FR-074K7P)
R67  Resistance: 4.7k  [RES-0402]  (hidden comment: RC0402FR-074K7P)
R68  Resistance: 10K Ohm +/- 5%  Power: 1/10 W  [RES-0402]  (hidden comment: ERJ2GEJ103X)
R69  Resistance: 10K Ohm +/- 5%  Power: 1/10 W  [RES-0402]  (hidden comment: ERJ2GEJ103X)
R70  Resistance: 10K Ohm +/- 5%  Power: 1/10 W  [RES-0402]  (hidden comment: ERJ2GEJ103X)
R71  Resistance: 10K Ohm +/- 5%  Power: 1/10 W  [RES-0402]  (hidden comment: ERJ2GEJ103X)
R72  Resistance: 10K Ohm +/- 5%  Power: 1/10 W  [RES-0402]  (hidden comment: ERJ2GEJ103X)
R73  Resistance: 10K Ohm +/- 5%  Power: 1/10 W  [RES-0402]  (hidden comment: ERJ2GEJ103X)
TP9  5003  [TEST-POINT-0001]  (value not drawn)
TP10  5003  [TEST-POINT-0001]  (value not drawn)
TP11  5003  [TEST-POINT-0001]  (value not drawn)
U4  TCAN1042HGDRBTQ1  [IC-8-VSON]
U5  STM32G431CBT6  [LQFP48-7x7mm]
U6  TCA9546APWR  [PW0016A-IPC_A]
X1  Molex 43045-0412  [43045-0412]
X2  Molex 43045-0412  [43045-0412]

### Ports
5V_BUCK_MAIN, HEATER_B0 (in, see MOSFETS[1B]), HEATER_B1 (in, see MOSFETS[1C]), HEATER_B2 (in, see MOSFETS[1D]), HEATER_N0 (in, see MOSFETS[1A]), HEATER_N1 (in, see MOSFETS[1B]), HEATER_N2 (in, see MOSFETS[1C]), SPECTRAL_0_SCL (out, see MOSFETS[3C]), SPECTRAL_0_SDA (out, see MOSFETS[3C]), SPECTRAL_1_SCL (out, see MOSFETS[3D]), SPECTRAL_1_SDA (out, see MOSFETS[3D]), SPECTRAL_2_SCL (out, see MOSFETS[4D]), SPECTRAL_2_SDA (out, see MOSFETS[4D]), THERM_B0 (out, see MOSFETS[3C]), THERM_B1 (out, see MOSFETS[3D]), THERM_B2 (out, see MOSFETS[4D]), THERM_N0 (out, see MOSFETS[3C]), THERM_N1 (out, see MOSFETS[3D]), THERM_N2 (out, see MOSFETS[4D]), UV_LED_0 (in, see MOSFETS[5A]), UV_LED_1 (in, see MOSFETS[5A]), UV_LED_2 (in, see MOSFETS[5B]), WHITE_LED_0 (in, see MOSFETS[3A]), WHITE_LED_1 (in, see MOSFETS[3B]), WHITE_LED_2 (in, see MOSFETS[3B])

### Nets
3V3_BUCK_MAIN: U6.16(VCC)
5V: C59.1 C60.1 U4.3(VCC) ; port 5V_BUCK_MAIN  [also labelled 5V_BUCK_MAIN]
GND: C59.2 C60.2 C61.2 C62.2 C63.2 C64.2 C65.2 C66.2 C67.2 C68.2 P1.3 Q1.2(S) Q18.2(S) Q19.2(S) R29.1 R59.2 R60.2 R61.2 U4.2(GND) U4.9(EP) U5.19(VSSA) U5.23(VSS) U5.35(VSS) U5.45(I2C1_SCL) U5.47(VSS) U6.1(A0) U6.2(A1) U6.8(GND) U6.13(A2) X1.P$2(2) X1.P$4(4) X2.P$2(2) X2.P$4(4)
VBAT_MCU: C61.1 C62.1 C63.1 C64.1 C65.1 C66.1 C67.1 C68.1 R1.1 R2.1 R27.2 R28.2 R55.1 R62.2 R63.2 R64.2 R65.2 R66.2 R67.2 R68.2 R69.2 R70.2 R71.2 R72.2 R73.2 TP9.1 U5.1(VBAT) U5.20(VREF+) U5.21(VDDA) U5.24(VDD) U5.36(VDD) U5.48(VDD)  [also labelled 3V3_LDO_MAIN, VDD, VDDA, VREF+]
CAN_N: R30.1 U4.6(CANL) X1.P$3(3) X2.P$3(3)
CAN_P: R30.2 U4.7(CANH) X1.P$1(1) X2.P$1(1)
CAN_STB: R29.2 U4.8(STB)
DEBUG_LED_0: R56.1 U5.2(PC13)
DEBUG_LED_1: R57.1 U5.3(PC14)
DEBUG_LED_2: R58.1 U5.4(PC15)
FDCAN_RX: U4.4(RXD) U5.33(FDCAN_Rx)
FDCAN_TX: U4.1(TXD) U5.34(FDCAN_Tx)
I2C1_SCL: R28.1 TP11.1 U5.31(PA9) U6.14(SCL)
I2C1_SDA: R27.1 TP10.1 U5.30(PA8) U6.15(SDA)
I2C_MUX_RST: U5.32(PA10) U6.3(RESET_N)
SYS_JTCK_SWCLK: P1.1 U5.38(SWCLK)
SYS_JTMS_SWDIO: P1.2 U5.37(SWDIO)
THERM_B0: R69.1 U5.11(USART2_Rx) ; port THERM_B0
THERM_B1: R71.1 U5.26(PB12) ; port THERM_B1
THERM_B2: R73.1 U5.25(PB11) ; port THERM_B2
THERM_N0: R68.1 U5.5(PF0) ; port THERM_N0
THERM_N1: R70.1 U5.18(PB2) ; port THERM_N1
THERM_N2: R72.1 U5.17(PB1) ; port THERM_N2
UV_LED_0: U5.8(PA0) ; port UV_LED_0
UV_LED_1: U5.9(PA1) ; port UV_LED_1
UV_LED_2: U5.10(USART2_Tx) ; port UV_LED_2
NetD1_1: D1.1 R1.2
NetD1_2: D1.2 Q1.3(D)
NetD6_1: D6.1 R2.2
NetD6_2: D6.2 Q18.3(D)
NetD7_1: D7.1 R55.2
NetD7_2: D7.2 Q19.3(D)
NetQ1_1: Q1.1(G) R56.2 R59.1
NetQ18_1: Q18.1(G) R57.2 R60.1
NetQ19_1: Q19.1(G) R58.2 R61.1
NetR31_1: U5.40(PB3) ; port HEATER_N0
NetR32_1: U5.14(PA6) ; port WHITE_LED_0
NetR38_1: U5.39(PA15) ; port HEATER_B0
NetR39_1: U5.15(PA7) ; port WHITE_LED_1
NetR44_1: U5.42(PB5) ; port HEATER_N1
NetR46_1: U5.16(PB0) ; port WHITE_LED_2
NetR49_1: U5.41(PB4) ; port HEATER_B1
NetR51_1: U5.44(PB7) ; port HEATER_N2
NetR53_1: U5.43(PB6) ; port HEATER_B2
NetR62_1: R62.1 U6.4(SD0) ; port SPECTRAL_0_SCL
NetR63_1: R63.1 U6.5(SC0) ; port SPECTRAL_0_SDA
NetR64_1: R64.1 U6.6(SD1) ; port SPECTRAL_1_SCL
NetR65_1: R65.1 U6.7(SC1) ; port SPECTRAL_1_SDA
NetR66_1: R66.1 U6.9(SD2) ; port SPECTRAL_2_SCL
NetR67_1: R67.1 U6.10(SC2) ; port SPECTRAL_2_SDA

Not connected (* = marked no-connect by the designer): U4 5(NC)*; U5 6(PF1)* 7(NRST)* 12(PA4)* 13(PA5)* 22(PB10)* 27(PB13) 28(PB14) 29(PB15) 46(I2C1_SDA)*; U6 11(SD3)* 12(SC3)*

### Layout directives
differential pair: CAN_N, CAN_P

### Notes on the sheet
- (near C60) MCU POWER DIST + FILT
- (near U4) CAN TRANSCEIVER
- Power (refer to page 68 of datasheet)
- DEBUG LEDS
- I2C MUX
- Boot pin
- MCU

### Library data of the parts
C59 C61 = CAP-4.7U-0001: 4.7 µF ±10% 25V Ceramic Capacitor X5R 0603 (1608 Metric); Manufacturer: Taiyo Yuden; Assembled?: no; Manufacturer Part Number: TMK107BBJ475KA-T; Temperature Coefficient: X5R; Package Size: 0603
C60 C62-C64 C66 = CAP-100N-0001: as C14 on sheet 12V_Buck; Manufacturer Part Number: CC0603KRX7R0BB104; Temperature Coefficient: X7R; Package Size: 0603
C65 C67 = CAP-1U-0002: as C30 on sheet 12V_Buck; Package Size: 0603
C68 = CAP-10N-0001: 10000 pF ±10% 100V Ceramic Capacitor X7R 0402 (1005 Metric); Manufacturer: YAGEO; Assembled?: no; Manufacturer Part Number: CC0402KRX7R0BB103; Temperature Coefficient: X7R; Package Size: 0402
D1 D6 D7 = LED_Amber_0001: as D3 on sheet 12V_Buck; Manufacturer Part Number: 150060AS75000; Package Size: 0603
P1 = Header 3: Header, 3-Pin; LatestRevisionDate: 17-Jul-2002; LatestRevisionNote: Re-released for DXP Platform.; Publisher: Altium Limited
Q1 Q18 Q19 = NMOS-200MA-0001: as Q3 on sheet 12V_Buck; Manufacturer Part Number: T2N7002AK,LM; Package: SOT-23-3
R1 R2 R55 = RES-100-0002: as R8 on sheet 12V_Buck; Manufacturer Part Number: AC0603FR-10100RL; Package Size: 0603
R27-R29 R62-R67 = RES-4.7K-0001: RES SMD 4.7K OHM 1% 1/16W 0402; Manufacturer: YAGEO; Assembled?: no; Manufacturer Part Number: RC0402FR-074K7P; Package Size: 0402
  R62-R67: Power Rating: 1/16W
R30 = RES-120-0002: 120 Ohms ±1% 0.5W, 1/2W Chip Resistor 1206 (3216 Metric) Thick Film; Tolerance: 1%; Package Size: 1206
R56-R58 = RES-33-0003-JLC: 100mW Thick Film Resistors ±100ppm/℃ ±1% -55℃~+155℃ 33Ω 0402  Chip Resistor - Surface Mount ROHS; assembled?: yes; JLC part number: C278594
R59-R61 = RES-10K-0002: as R10 on sheet 12V_Buck; Manufacturer Part Number: RC0603FR-0710KP; Package Size: 0603
R68-R73 = RES-10K-0003-JLC: 100mW Thick Film Resistors 100V ±5% ±200ppm/℃ -55℃~+155℃ 10kΩ 0402  Chip Resistor - Surface Mount ROHS; assembled?: yes; JLC part number: C278577
TP9-TP11 = TEST-POINT-0001: as TP1 on sheet 12V_Buck
U4 = IC-CAN-TRANSCEIVER-0002: 1/1 Transceiver CANbus 8-VSON (3x3); Manufacturer: Texas Instrument; CAN Capability: FD-CAN; Manufacturer Part Number: TCAN1042HGDRBTQ1
U5 = IC-STM32G431CBT6-0001: ARM® Cortex®-M4F STM32G4 Microcontroller IC 32-Bit Single-Core 170MHz 128KB (128K x 8) FLASH 48-LQFP (7x7); Parameter 1: *
U6 = IC-MUX-0003: Multiplexer Switch ICs I2C SWITCH 4CH; Mfr_Name: Texas Instruments; Type: DEV; RefDes: RefDes; Copyright: Copyright (C) 2023 Ultra Librarian. All rights reserved.; Manufacturer_Part_Number: TCA9546APWR
X1 X2 = Micro-Fit Molex 4 Pin 2 Row Vertical: GateName_1: G$1; SymbolName_1: HEADER_POS4; DeviceSetName: HEADER_POS4_?; DeviceName: 43045-0412; LibraryName: con-molex-micro-fit-3_0_2; Package: 43045-0412

## Sheet 3v3_LDO.SchDoc
size A; SheetNumber: 6; SheetTotal: 8
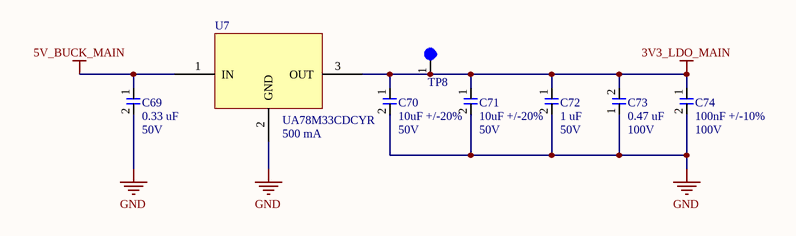
[diagram p4: 3v3_LDO.SchDoc]

### Parts
C69  Capacitance: 0.33 uF  Voltage: 50V  [CAP-0603]  (hidden comment: CGA3E3X7R1H334K080AB)
C70  Capacitance: 10uF +/-20%  Voltage Rating: 50V  [CAP-1206]  (hidden comment: CL31B106KBHNNNE)
C71  Capacitance: 10uF +/-20%  Voltage Rating: 50V  [CAP-1206]  (hidden comment: CL31B106KBHNNNE)
C72  Capacitance: 1 uF  Voltage: 50V  [CAP-0603]  (hidden comment: UMK107AB7105KA-T)
C73  Capacitance: 0.47 uF  Voltage: 100V  [CAP-0805]  (hidden comment: KAM21KR72A474KL)
C74  Capacitance: 100nF +/-10%  Voltage Rating: 100V  [CAP-0603]  (hidden comment: CC0603KRX7R0BB104)
TP8  5003  [TEST-POINT-0001]  (value not drawn)
U7  UA78M33CDCYR  Current: 500 mA  [IC-SOT-223-4]

### Nets
3V3_LDO_MAIN: C70.1 C71.1 C72.1 C73.2 C74.1 TP8.1 U7.3(OUT)  [project net VBAT_MCU]
5V_BUCK_MAIN: C69.1 U7.1(IN)  [project net 5V]
GND: C69.2 C70.2 C71.2 C72.2 C73.1 C74.2 U7.2(GND)

### Library data of the parts
C69 = CAP-0.33uF-0001: 0.33 µF ±10% 50V Ceramic Capacitor X7R 0603 (1608 Metric); Manufacturer: TDK Corporation; Tolerance: +/- 10%; Manufacturer Part Number: CGA3E3X7R1H334K080AB; Temperature Coefficient: X7R
C70 C71 = CAP-10U-0001: as C33 on sheet 5V_Buck; Manufacturer Part Number: CL31B106KBHNNNE; Temperature Coefficient: X7R; Package Size: 1206
C72 = CAP-1U-0002: as C30 on sheet 12V_Buck; Package Size: 0603
C73 = CAP-0.47U-0001: as C13 on sheet 12V_Buck; Temperature Coefficient: X7R; Package Size: 0805
C74 = CAP-100N-0001: as C14 on sheet 12V_Buck; Manufacturer Part Number: CC0603KRX7R0BB104; Temperature Coefficient: X7R; Package Size: 0603
TP8 = TEST-POINT-0001: as TP1 on sheet 12V_Buck
U7 = IC-LDO-3.3V-0002: Linear Voltage Regulator IC Positive Fixed 1 Output 500mA SOT-223-4; Vin: 25V; Vout: 3.3V; Package: SOT-223-4

## Sheet MOSFETS.SchDoc
size B; SheetNumber: 6; SheetTotal: 6
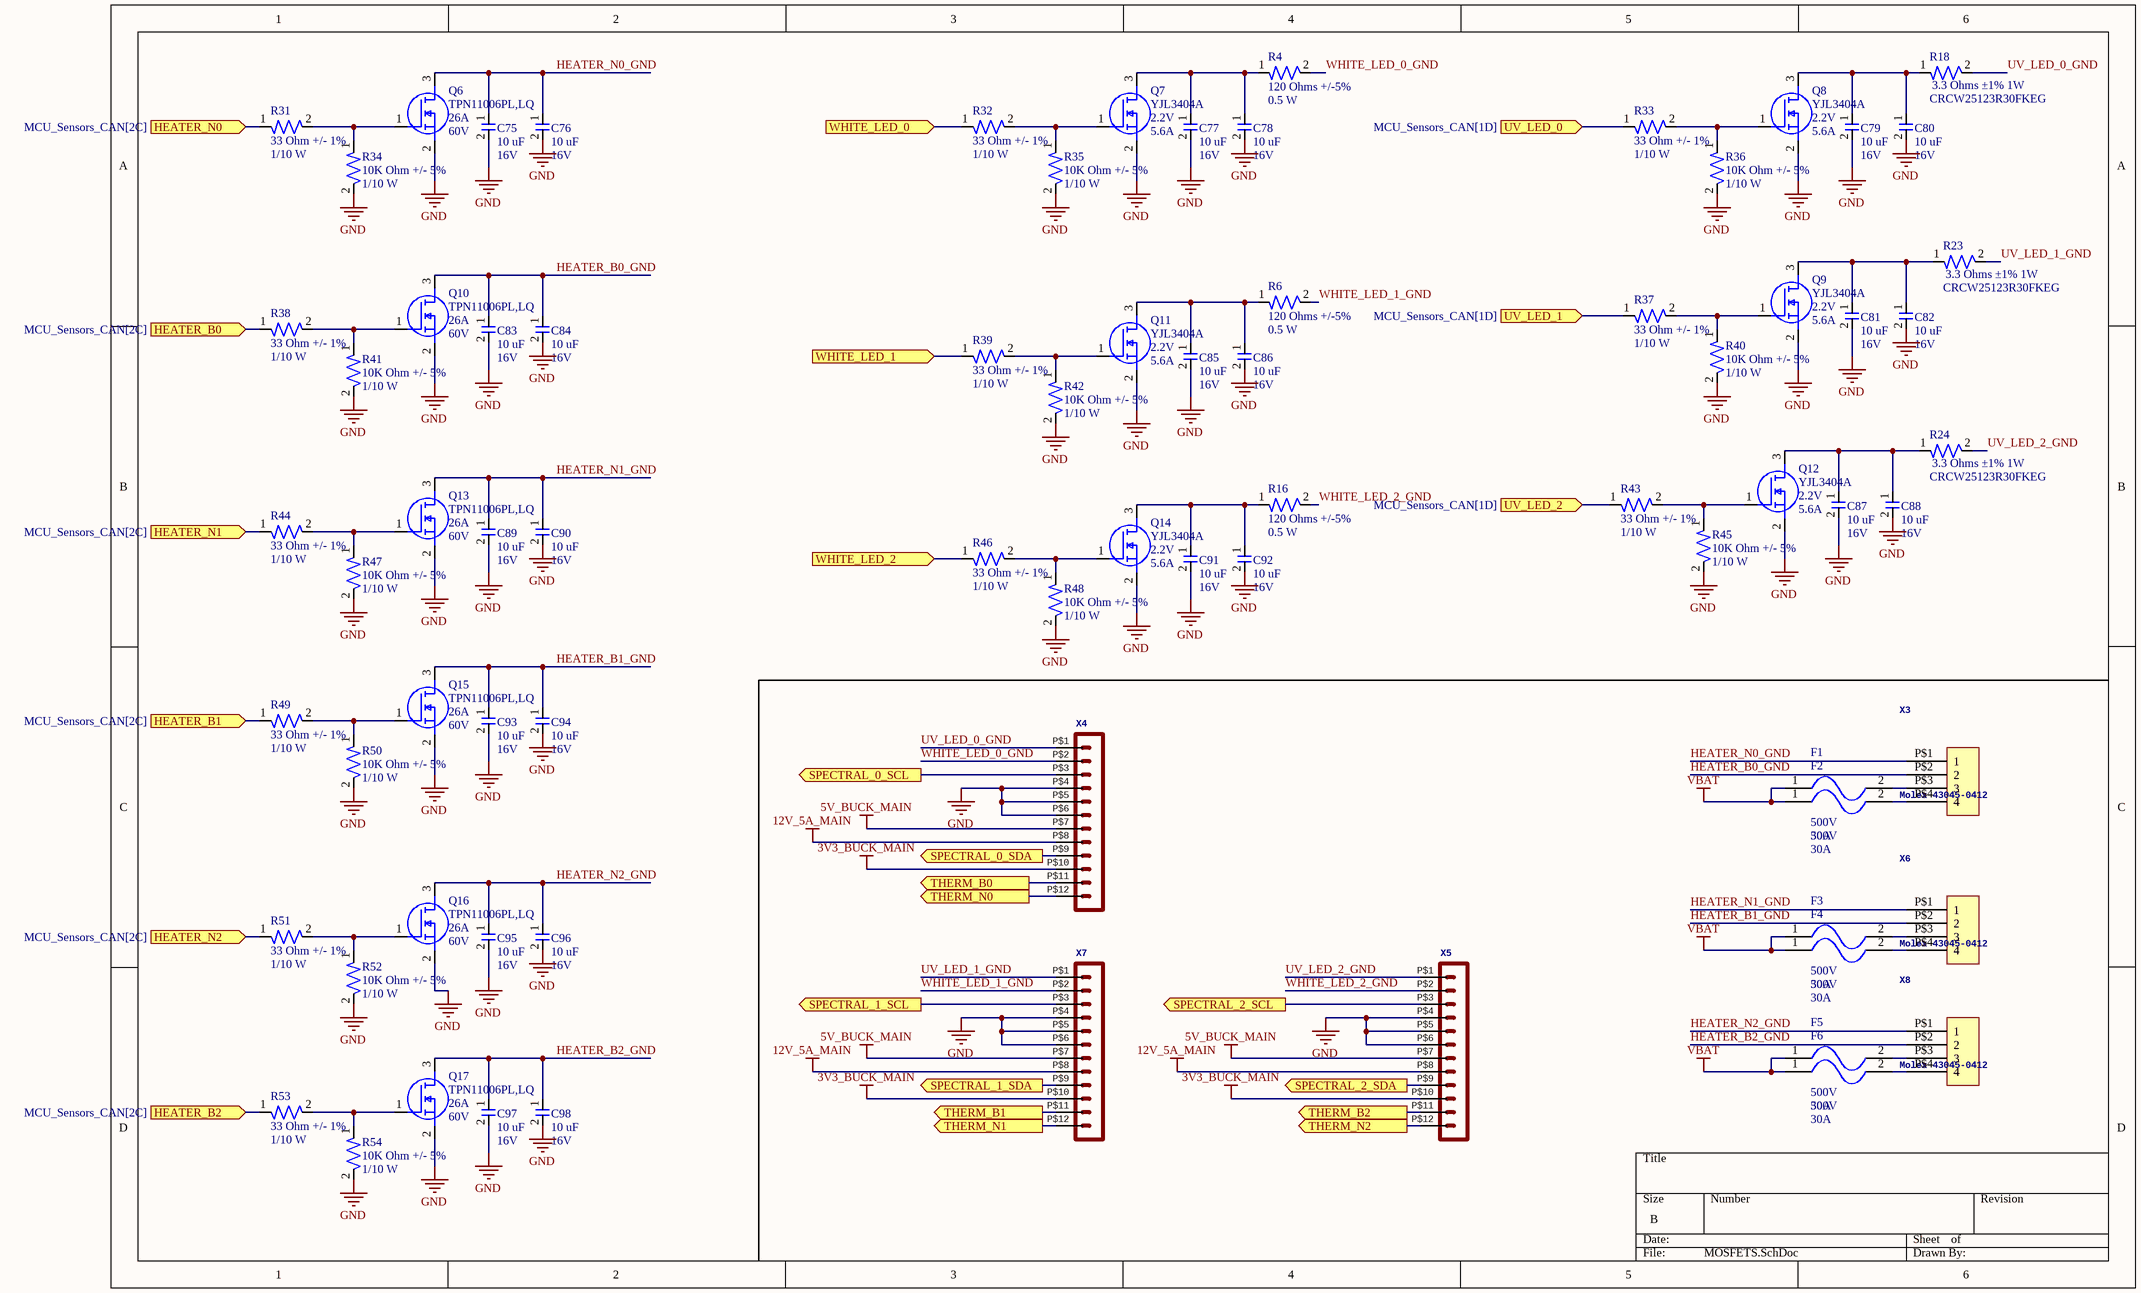
[diagram p5: MOSFETS.SchDoc]

### Parts
C75  Capacitance: 10 uF  Voltage Rating: 16V  [CAP-0805]  (hidden comment: CL21A106KOQNNNE)
C76  Capacitance: 10 uF  Voltage Rating: 16V  [CAP-0805]  (hidden comment: CL21A106KOQNNNE)
C77  Capacitance: 10 uF  Voltage Rating: 16V  [CAP-0805]  (hidden comment: CL21A106KOQNNNE)
C78  Capacitance: 10 uF  Voltage Rating: 16V  [CAP-0805]  (hidden comment: CL21A106KOQNNNE)
C79  Capacitance: 10 uF  Voltage Rating: 16V  [CAP-0805]  (hidden comment: CL21A106KOQNNNE)
C80  Capacitance: 10 uF  Voltage Rating: 16V  [CAP-0805]  (hidden comment: CL21A106KOQNNNE)
C81  Capacitance: 10 uF  Voltage Rating: 16V  [CAP-0805]  (hidden comment: CL21A106KOQNNNE)
C82  Capacitance: 10 uF  Voltage Rating: 16V  [CAP-0805]  (hidden comment: CL21A106KOQNNNE)
C83  Capacitance: 10 uF  Voltage Rating: 16V  [CAP-0805]  (hidden comment: CL21A106KOQNNNE)
C84  Capacitance: 10 uF  Voltage Rating: 16V  [CAP-0805]  (hidden comment: CL21A106KOQNNNE)
C85  Capacitance: 10 uF  Voltage Rating: 16V  [CAP-0805]  (hidden comment: CL21A106KOQNNNE)
C86  Capacitance: 10 uF  Voltage Rating: 16V  [CAP-0805]  (hidden comment: CL21A106KOQNNNE)
C87  Capacitance: 10 uF  Voltage Rating: 16V  [CAP-0805]  (hidden comment: CL21A106KOQNNNE)
C88  Capacitance: 10 uF  Voltage Rating: 16V  [CAP-0805]  (hidden comment: CL21A106KOQNNNE)
C89  Capacitance: 10 uF  Voltage Rating: 16V  [CAP-0805]  (hidden comment: CL21A106KOQNNNE)
C90  Capacitance: 10 uF  Voltage Rating: 16V  [CAP-0805]  (hidden comment: CL21A106KOQNNNE)
C91  Capacitance: 10 uF  Voltage Rating: 16V  [CAP-0805]  (hidden comment: CL21A106KOQNNNE)
C92  Capacitance: 10 uF  Voltage Rating: 16V  [CAP-0805]  (hidden comment: CL21A106KOQNNNE)
C93  Capacitance: 10 uF  Voltage Rating: 16V  [CAP-0805]  (hidden comment: CL21A106KOQNNNE)
C94  Capacitance: 10 uF  Voltage Rating: 16V  [CAP-0805]  (hidden comment: CL21A106KOQNNNE)
C95  Capacitance: 10 uF  Voltage Rating: 16V  [CAP-0805]  (hidden comment: CL21A106KOQNNNE)
C96  Capacitance: 10 uF  Voltage Rating: 16V  [CAP-0805]  (hidden comment: CL21A106KOQNNNE)
C97  Capacitance: 10 uF  Voltage Rating: 16V  [CAP-0805]  (hidden comment: CL21A106KOQNNNE)
C98  Capacitance: 10 uF  Voltage Rating: 16V  [CAP-0805]  (hidden comment: CL21A106KOQNNNE)
F1  Voltage Rating: 500V  Current: 30A  [FUSE-ATM-0001]  (hidden comment: 3568)
F2  Voltage Rating: 500V  Current: 30A  [FUSE-ATM-0001]  (hidden comment: 3568)
F3  Voltage Rating: 500V  Current: 30A  [FUSE-ATM-0001]  (hidden comment: 3568)
F4  Voltage Rating: 500V  Current: 30A  [FUSE-ATM-0001]  (hidden comment: 3568)
F5  Voltage Rating: 500V  Current: 30A  [FUSE-ATM-0001]  (hidden comment: 3568)
F6  Voltage Rating: 500V  Current: 30A  [FUSE-ATM-0001]  (hidden comment: 3568)
Q6  TPN11006PL,LQ  Id-Continuous: 26A  VDS-Max: 60V  [NMOS-8TSON]
Q7  YJL3404A  Vgs(th): 2.2V  Drain Current: 5.6A  [NMOS-SOT23-3]
Q8  YJL3404A  Vgs(th): 2.2V  Drain Current: 5.6A  [NMOS-SOT23-3]
Q9  YJL3404A  Vgs(th): 2.2V  Drain Current: 5.6A  [NMOS-SOT23-3]
Q10  TPN11006PL,LQ  Id-Continuous: 26A  VDS-Max: 60V  [NMOS-8TSON]
Q11  YJL3404A  Vgs(th): 2.2V  Drain Current: 5.6A  [NMOS-SOT23-3]
Q12  YJL3404A  Vgs(th): 2.2V  Drain Current: 5.6A  [NMOS-SOT23-3]
Q13  TPN11006PL,LQ  Id-Continuous: 26A  VDS-Max: 60V  [NMOS-8TSON]
Q14  YJL3404A  Vgs(th): 2.2V  Drain Current: 5.6A  [NMOS-SOT23-3]
Q15  TPN11006PL,LQ  Id-Continuous: 26A  VDS-Max: 60V  [NMOS-8TSON]
Q16  TPN11006PL,LQ  Id-Continuous: 26A  VDS-Max: 60V  [NMOS-8TSON]
Q17  TPN11006PL,LQ  Id-Continuous: 26A  VDS-Max: 60V  [NMOS-8TSON]
R4  Resistance: 120 Ohms +/-5%  Power: 0.5 W  [RES-0805]  (hidden comment: ERJ-P06J121V)
R6  Resistance: 120 Ohms +/-5%  Power: 0.5 W  [RES-0805]  (hidden comment: ERJ-P06J121V)
R16  Resistance: 120 Ohms +/-5%  Power: 0.5 W  [RES-0805]  (hidden comment: ERJ-P06J121V)
R18  CRCW25123R30FKEG  [RC2512N_VIS]
R23  CRCW25123R30FKEG  [RC2512N_VIS]
R24  CRCW25123R30FKEG  [RC2512N_VIS]
R31  Resistance: 33 Ohm +/- 1%  Power: 1/10 W  [RES-0402]  (hidden comment: ERJ2RKF33R0X)
R32  Resistance: 33 Ohm +/- 1%  Power: 1/10 W  [RES-0402]  (hidden comment: ERJ2RKF33R0X)
R33  Resistance: 33 Ohm +/- 1%  Power: 1/10 W  [RES-0402]  (hidden comment: ERJ2RKF33R0X)
R34  Resistance: 10K Ohm +/- 5%  Power: 1/10 W  [RES-0402]  (hidden comment: ERJ2GEJ103X)
R35  Resistance: 10K Ohm +/- 5%  Power: 1/10 W  [RES-0402]  (hidden comment: ERJ2GEJ103X)
R36  Resistance: 10K Ohm +/- 5%  Power: 1/10 W  [RES-0402]  (hidden comment: ERJ2GEJ103X)
R37  Resistance: 33 Ohm +/- 1%  Power: 1/10 W  [RES-0402]  (hidden comment: ERJ2RKF33R0X)
R38  Resistance: 33 Ohm +/- 1%  Power: 1/10 W  [RES-0402]  (hidden comment: ERJ2RKF33R0X)
R39  Resistance: 33 Ohm +/- 1%  Power: 1/10 W  [RES-0402]  (hidden comment: ERJ2RKF33R0X)
R40  Resistance: 10K Ohm +/- 5%  Power: 1/10 W  [RES-0402]  (hidden comment: ERJ2GEJ103X)
R41  Resistance: 10K Ohm +/- 5%  Power: 1/10 W  [RES-0402]  (hidden comment: ERJ2GEJ103X)
R42  Resistance: 10K Ohm +/- 5%  Power: 1/10 W  [RES-0402]  (hidden comment: ERJ2GEJ103X)
R43  Resistance: 33 Ohm +/- 1%  Power: 1/10 W  [RES-0402]  (hidden comment: ERJ2RKF33R0X)
R44  Resistance: 33 Ohm +/- 1%  Power: 1/10 W  [RES-0402]  (hidden comment: ERJ2RKF33R0X)
R45  Resistance: 10K Ohm +/- 5%  Power: 1/10 W  [RES-0402]  (hidden comment: ERJ2GEJ103X)
R46  Resistance: 33 Ohm +/- 1%  Power: 1/10 W  [RES-0402]  (hidden comment: ERJ2RKF33R0X)
R47  Resistance: 10K Ohm +/- 5%  Power: 1/10 W  [RES-0402]  (hidden comment: ERJ2GEJ103X)
R48  Resistance: 10K Ohm +/- 5%  Power: 1/10 W  [RES-0402]  (hidden comment: ERJ2GEJ103X)
R49  Resistance: 33 Ohm +/- 1%  Power: 1/10 W  [RES-0402]  (hidden comment: ERJ2RKF33R0X)
R50  Resistance: 10K Ohm +/- 5%  Power: 1/10 W  [RES-0402]  (hidden comment: ERJ2GEJ103X)
R51  Resistance: 33 Ohm +/- 1%  Power: 1/10 W  [RES-0402]  (hidden comment: ERJ2RKF33R0X)
R52  Resistance: 10K Ohm +/- 5%  Power: 1/10 W  [RES-0402]  (hidden comment: ERJ2GEJ103X)
R53  Resistance: 33 Ohm +/- 1%  Power: 1/10 W  [RES-0402]  (hidden comment: ERJ2RKF33R0X)
R54  Resistance: 10K Ohm +/- 5%  Power: 1/10 W  [RES-0402]  (hidden comment: ERJ2GEJ103X)
X3  Molex 43045-0412  [43045-0412]
X4  Molex - Micro-Fit 3.0 Series connector,  3.00mm (0.118") pitch header, 12 positions.  [43045-1212]  (value not drawn)
X5  Molex - Micro-Fit 3.0 Series connector,  3.00mm (0.118") pitch header, 12 positions.  [43045-1212]  (value not drawn)
X6  Molex 43045-0412  [43045-0412]
X7  Molex - Micro-Fit 3.0 Series connector,  3.00mm (0.118") pitch header, 12 positions.  [43045-1212]  (value not drawn)
X8  Molex 43045-0412  [43045-0412]

### Ports
HEATER_B0 (in, see MCU_Sensors_CAN[2C]), HEATER_B1 (in, see MCU_Sensors_CAN[2C]), HEATER_B2 (in, see MCU_Sensors_CAN[2C]), HEATER_N0 (in, see MCU_Sensors_CAN[2C]), HEATER_N1 (in, see MCU_Sensors_CAN[2C]), HEATER_N2 (in, see MCU_Sensors_CAN[2C]), SPECTRAL_0_SCL (out, see MCU_Sensors_CAN[5C]), SPECTRAL_0_SDA (out, see MCU_Sensors_CAN[5C]), SPECTRAL_1_SCL (out, see MCU_Sensors_CAN[5C]), SPECTRAL_1_SDA (out, see MCU_Sensors_CAN[5C]), SPECTRAL_2_SCL (out, see MCU_Sensors_CAN[5C]), SPECTRAL_2_SDA (out, see MCU_Sensors_CAN[5C]), THERM_B0 (out, see MCU_Sensors_CAN[6C]), THERM_B1 (out, see MCU_Sensors_CAN[6C]), THERM_B2 (out, see MCU_Sensors_CAN[6D]), THERM_N0 (out, see MCU_Sensors_CAN[6B]), THERM_N1 (out, see MCU_Sensors_CAN[6C]), THERM_N2 (out, see MCU_Sensors_CAN[6C]), UV_LED_0 (in, see MCU_Sensors_CAN[1D]), UV_LED_1 (in, see MCU_Sensors_CAN[1D]), UV_LED_2 (in, see MCU_Sensors_CAN[1D]), WHITE_LED_0 (in, see MCU_Sensors_CAN[1D]), WHITE_LED_1 (in, see MCU_Sensors_CAN[1D]), WHITE_LED_2 (in, see MCU_Sensors_CAN[1D])

### Nets
3V3_BUCK_MAIN: X4.P$10 X5.P$10 X7.P$10
5V_BUCK_MAIN: X4.P$7 X5.P$7 X7.P$7  [project net 5V]
12V_5A_MAIN: X4.P$8 X5.P$8 X7.P$8
GND: C75.2 C76.2 C77.2 C78.2 C79.2 C80.2 C81.2 C82.2 C83.2 C84.2 C85.2 C86.2 C87.2 C88.2 C89.2 C90.2 C91.2 C92.2 C93.2 C94.2 C95.2 C96.2 C97.2 C98.2 Q6.2(S) Q7.2(S) Q8.2(S) Q9.2(S) Q10.2(S) Q11.2(S) Q12.2(S) Q13.2(S) Q14.2(S) Q15.2(S) Q16.2(S) Q17.2(S) R34.2 R35.2 R36.2 R40.2 R41.2 R42.2 R45.2 R47.2 R48.2 R50.2 R52.2 R54.2 X4.P$4 X4.P$5 X4.P$6 X5.P$4 X5.P$5 X5.P$6 X7.P$4 X7.P$5 X7.P$6
VBAT: F1.1 F2.1 F3.1 F4.1 F5.1 F6.1
HEATER_B0_GND: C83.1 C84.1 Q10.3(D) X3.P$2(2)
HEATER_B1_GND: C93.1 C94.1 Q15.3(D) X6.P$2(2)
HEATER_B2_GND: C97.1 C98.1 Q17.3(D) X8.P$2(2)
HEATER_N0_GND: C75.1 C76.1 Q6.3(D) X3.P$1(1)
HEATER_N1_GND: C89.1 C90.1 Q13.3(D) X6.P$1(1)
HEATER_N2_GND: C95.1 C96.1 Q16.3(D) X8.P$1(1)
THERM_B0: X4.P$11 ; port THERM_B0
THERM_B1: X7.P$11 ; port THERM_B1
THERM_B2: X5.P$11 ; port THERM_B2
THERM_N0: X4.P$12 ; port THERM_N0
THERM_N1: X7.P$12 ; port THERM_N1
THERM_N2: X5.P$12 ; port THERM_N2
UV_LED_0: R33.1 ; port UV_LED_0
UV_LED_0_GND: R18.2 X4.P$1
UV_LED_1: R37.1 ; port UV_LED_1
UV_LED_1_GND: R23.2 X7.P$1
UV_LED_2: R43.1 ; port UV_LED_2
UV_LED_2_GND: R24.2 X5.P$1
WHITE_LED_0_GND: R4.2 X4.P$2
WHITE_LED_1_GND: R6.2 X7.P$2
WHITE_LED_2_GND: R16.2 X5.P$2
NetC77_1: C77.1 C78.1 Q7.3(D) R4.1
NetC79_1: C79.1 C80.1 Q8.3(D) R18.1
NetC81_1: C81.1 C82.1 Q9.3(D) R23.1
NetC85_1: C85.1 C86.1 Q11.3(D) R6.1
NetC87_1: C87.1 C88.1 Q12.3(D) R24.1
NetC91_1: C91.1 C92.1 Q14.3(D) R16.1
NetF1_2: F1.2 X3.P$3(3)
NetF2_2: F2.2 X3.P$4(4)
NetF3_2: F3.2 X6.P$3(3)
NetF4_2: F4.2 X6.P$4(4)
NetF5_2: F5.2 X8.P$3(3)
NetF6_2: F6.2 X8.P$4(4)
NetQ6_1: Q6.1(G) R31.2 R34.1
NetQ7_1: Q7.1(G) R32.2 R35.1
NetQ8_1: Q8.1(G) R33.2 R36.1
NetQ9_1: Q9.1(G) R37.2 R40.1
NetQ10_1: Q10.1(G) R38.2 R41.1
NetQ11_1: Q11.1(G) R39.2 R42.1
NetQ12_1: Q12.1(G) R43.2 R45.1
NetQ13_1: Q13.1(G) R44.2 R47.1
NetQ14_1: Q14.1(G) R46.2 R48.1
NetQ15_1: Q15.1(G) R49.2 R50.1
NetQ16_1: Q16.1(G) R51.2 R52.1
NetQ17_1: Q17.1(G) R53.2 R54.1
NetR31_1: R31.1 ; port HEATER_N0
NetR32_1: R32.1 ; port WHITE_LED_0
NetR38_1: R38.1 ; port HEATER_B0
NetR39_1: R39.1 ; port WHITE_LED_1
NetR44_1: R44.1 ; port HEATER_N1
NetR46_1: R46.1 ; port WHITE_LED_2
NetR49_1: R49.1 ; port HEATER_B1
NetR51_1: R51.1 ; port HEATER_N2
NetR53_1: R53.1 ; port HEATER_B2
NetR62_1: X4.P$3 ; port SPECTRAL_0_SCL
NetR63_1: X4.P$9 ; port SPECTRAL_0_SDA
NetR64_1: X7.P$3 ; port SPECTRAL_1_SCL
NetR65_1: X7.P$9 ; port SPECTRAL_1_SDA
NetR66_1: X5.P$3 ; port SPECTRAL_2_SCL
NetR67_1: X5.P$9 ; port SPECTRAL_2_SDA

### Notes on the sheet
- (in symbol RES-3.3-0001) 3.3 Ohms ±1% 1W

### Library data of the parts
C75-C98 = CAP-10U-0002: 10 µF ±10% 16V Ceramic Capacitor X7R 0805 (2012 Metric); Package Size: 0805
F1-F6 = FUSE-ATM-0001: Fuse Holder 30 A 500V 1 Circuit Blade Through Hole; Manufacturer Part Number: 3568
Q6 Q10 Q13 Q15-Q17 = NMOS-26A-0001: N-Channel 60 V 26A (Tc) 610mW (Ta), 61W (Tc) Surface Mount 8-TSON Advance (3.1x3.1); Manufacturer: Toshiba; Rds On-Max: 18.1mOhm; Vgs-Max: 20V; Assembled?: no; Manufacturer Part Number: TPN11006PL,LQ; FET type: N-Channel; Package: 8-TSON Advance
Q7-Q9 Q11 Q12 Q14 = NMOS-5.6A-0001: N-Channel 30 V 5.6A (Ta) 1.2W (Ta) Surface Mount SOT-23; Vdss: 30V; Rds On: 24 mOhm; Manufacturer Part Number: YJL3404A; Package Size: SOT23
R4 R6 R16 = RES-120-0001: 120 Ohms ±5% 0.5W, 1/2W Chip Resistor 0805 (2012 Metric) Automotive AEC-Q200, Pulse Withstanding Thick Film
R18 R23 R24 = RES-3.3-0001: 3.3 Ohms ±1% 1W Chip Resistor 2512 (6432 Metric) Automotive AEC-Q200 Thick Film
R31-R33 R37-R39 R43 R44 R46 R49 R51 R53 = RES-33-0003-JLC: as R56 on sheet MCU_Sensors_CAN; JLC part number: C278594
R34-R36 R40-R42 R45 R47 R48 R50 R52 R54 = RES-10K-0003-JLC: as R68 on sheet MCU_Sensors_CAN; JLC part number: C278577
X3 X6 X8 = Micro-Fit Molex 4 Pin 2 Row Vertical: as X1 on sheet MCU_Sensors_CAN; DeviceName: 43045-0412; LibraryName: con-molex-micro-fit-3_0_2; Package: 43045-0412
X4 X5 X7 = HEADER_POS12_?43045-1212: GateName_1: G$1; SymbolName_1: HEADER_POS12; DeviceName: 43045-1212; LibraryName: con-molex-micro-fit-3_0_2; DeviceSetName: HEADER_POS12_?; Package: 43045-1212

## Nets that join several sheets
3V3_BUCK_MAIN: 3v3_Buck (13 pins), MCU_Sensors_CAN (U6.16), MOSFETS (X4.P$10 X5.P$10 X7.P$10)
5V: 5V_Buck (13 pins), MCU_Sensors_CAN (C59.1 C60.1 U4.3), 3v3_LDO (C69.1 U7.1), MOSFETS (X4.P$7 X5.P$7 X7.P$7)
12V_5A_MAIN: 12V_Buck (13 pins), 5V_Buck (8 pins), 3v3_Buck (9 pins), MOSFETS (X4.P$8 X5.P$8 X7.P$8)
GND: 12V_Buck (40 pins), 5V_Buck (17 pins), 3v3_Buck (19 pins), MCU_Sensors_CAN (33 pins), 3v3_LDO (7 pins), MOSFETS (57 pins)
VBAT: 12V_Buck (16 pins), MOSFETS (6 pins)
VBAT_MCU: MCU_Sensors_CAN (32 pins), 3v3_LDO (7 pins)
12V_5A_PG: 12V_Buck (Q3.1 R10.1 U1.16), 5V_Buck (U2.6), 3v3_Buck (U3.2)
NetR31_1: MCU_Sensors_CAN (U5.40), MOSFETS (R31.1)
NetR32_1: MCU_Sensors_CAN (U5.14), MOSFETS (R32.1)
NetR38_1: MCU_Sensors_CAN (U5.39), MOSFETS (R38.1)
NetR39_1: MCU_Sensors_CAN (U5.15), MOSFETS (R39.1)
NetR44_1: MCU_Sensors_CAN (U5.42), MOSFETS (R44.1)
NetR46_1: MCU_Sensors_CAN (U5.16), MOSFETS (R46.1)
NetR49_1: MCU_Sensors_CAN (U5.41), MOSFETS (R49.1)
NetR51_1: MCU_Sensors_CAN (U5.44), MOSFETS (R51.1)
NetR53_1: MCU_Sensors_CAN (U5.43), MOSFETS (R53.1)
NetR62_1: MCU_Sensors_CAN (R62.1 U6.4), MOSFETS (X4.P$3)
NetR63_1: MCU_Sensors_CAN (R63.1 U6.5), MOSFETS (X4.P$9)
NetR64_1: MCU_Sensors_CAN (R64.1 U6.6), MOSFETS (X7.P$3)
NetR65_1: MCU_Sensors_CAN (R65.1 U6.7), MOSFETS (X7.P$9)
NetR66_1: MCU_Sensors_CAN (R66.1 U6.9), MOSFETS (X5.P$3)
NetR67_1: MCU_Sensors_CAN (R67.1 U6.10), MOSFETS (X5.P$9)
THERM_B0: MCU_Sensors_CAN (R69.1 U5.11), MOSFETS (X4.P$11)
THERM_B1: MCU_Sensors_CAN (R71.1 U5.26), MOSFETS (X7.P$11)
THERM_B2: MCU_Sensors_CAN (R73.1 U5.25), MOSFETS (X5.P$11)
THERM_N0: MCU_Sensors_CAN (R68.1 U5.5), MOSFETS (X4.P$12)
THERM_N1: MCU_Sensors_CAN (R70.1 U5.18), MOSFETS (X7.P$12)
THERM_N2: MCU_Sensors_CAN (R72.1 U5.17), MOSFETS (X5.P$12)
UV_LED_0: MCU_Sensors_CAN (U5.8), MOSFETS (R33.1)
UV_LED_1: MCU_Sensors_CAN (U5.9), MOSFETS (R37.1)
UV_LED_2: MCU_Sensors_CAN (U5.10), MOSFETS (R43.1)